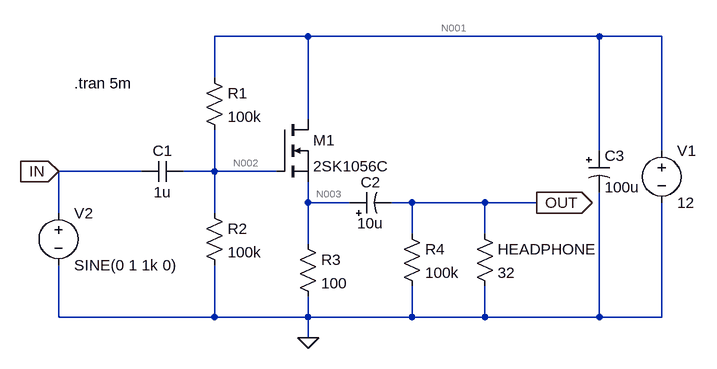
[diagram p0: schematic Circuit7_17.asc]
Circuit7_17.asc, the LTspice schematic file:
Version 4
SHEET 1 880 680
WIRE 160 96 16 96
WIRE 608 96 160 96
WIRE 704 96 608 96
WIRE 16 160 16 96
WIRE 160 224 160 96
WIRE 608 272 608 96
WIRE 704 272 704 96
WIRE -96 304 -224 304
WIRE 16 304 16 240
WIRE 16 304 -32 304
WIRE 112 304 16 304
WIRE 160 352 160 320
WIRE 224 352 160 352
WIRE 320 352 288 352
WIRE 432 352 320 352
WIRE 512 352 432 352
WIRE -224 368 -224 304
WIRE 16 368 16 304
WIRE 320 400 320 352
WIRE 432 400 432 352
WIRE 160 416 160 352
WIRE -224 528 -224 448
WIRE 16 528 16 448
WIRE 16 528 -224 528
WIRE 160 528 160 496
WIRE 160 528 16 528
WIRE 320 528 320 480
WIRE 320 528 160 528
WIRE 432 528 432 480
WIRE 432 528 320 528
WIRE 608 528 608 336
WIRE 608 528 432 528
WIRE 704 528 704 352
WIRE 704 528 608 528
WIRE 160 560 160 528
FLAG 160 560 0
FLAG -224 304 IN
IOPIN -224 304 In
FLAG 512 352 OUT
IOPIN 512 352 Out
SYMBOL voltage 704 256 R0
SYMATTR InstName V1
SYMATTR Value 12
SYMBOL cap -32 288 R90
WINDOW 0 0 32 VBottom 2
WINDOW 3 32 32 VTop 2
SYMATTR InstName C1
SYMATTR Value 1u
SYMBOL res 0 144 R0
SYMATTR InstName R1
SYMATTR Value 100k
SYMBOL res 0 352 R0
SYMATTR InstName R2
SYMATTR Value 100k
SYMBOL res 144 400 R0
SYMATTR InstName R3
SYMATTR Value 100
SYMBOL voltage -224 352 R0
SYMATTR InstName V2
SYMATTR Value SINE(0 1 1k 0)
SYMBOL polcap 224 368 R270
WINDOW 0 32 32 VTop 2
WINDOW 3 0 32 VBottom 2
SYMATTR InstName C2
SYMATTR Value 10u
SYMBOL res 304 384 R0
SYMATTR InstName R4
SYMATTR Value 100k
SYMBOL polcap 592 272 R0
SYMATTR InstName C3
SYMATTR Value 100u
SYMBOL nmos 112 224 R0
SYMATTR InstName M1
SYMATTR Value 2SK1056C
SYMBOL res 416 384 R0
SYMATTR InstName HEADPHONE
SYMATTR Value 32
TEXT -200 168 Left 2 !.tran 5m

The netlist it stands for:
* Circuit7_17.asc
V1 N001 0 12
C1 N002 IN 1u
R1 N001 N002 100k
R2 N002 0 100k
R3 N003 0 100
V2 IN 0 SINE(0 1 1k 0)
C2 N003 OUT 10u
R4 OUT 0 100k
C3 N001 0 100u
M1 N001 N002 N003 N003 2SK1056C
R§HEADPHONE OUT 0 32
.model NMOS NMOS
.model PMOS PMOS
.lib standard.mos
.tran 5m
.backanno
.end

* Results of the author's LTspice run, read from the files saved beside the schematic
* Operating Point, zero values left out:
*   V(n001) = 12 V
*   V(n002) = 6 V
*   V(n003) = 5.603 V
*   Id(M1) = 56.03 mA
*   Is(M1) = -56.03 mA
*   I(R3) = 56.03 mA
*   I(R2) = 60 µA
*   I(R1) = 60 µA
*   I(V1) = -56.09 mA
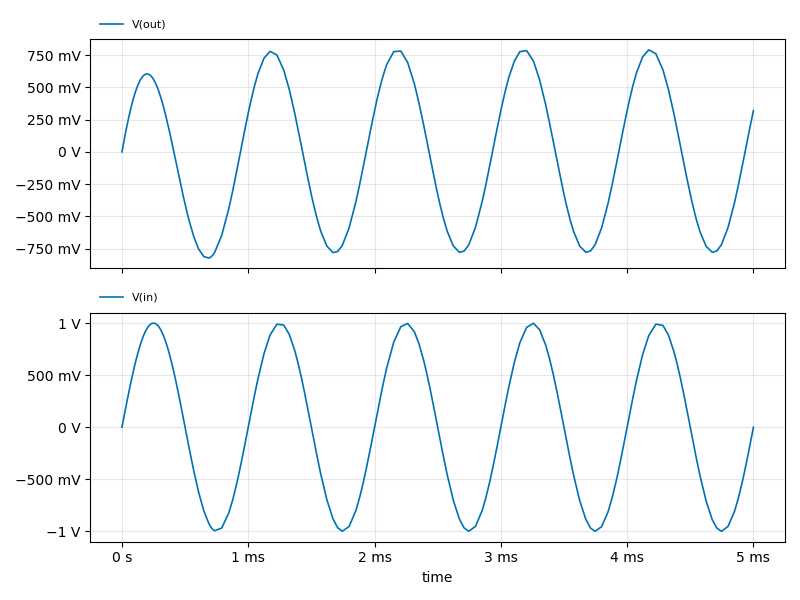
[diagram p1: Transient Analysis of Circuit7_17.asc, plotted from the saved traces]
* Transient Analysis, 1 run:
*   V(out): min -822.9 mV, max 791.3 mV, average -22.68 mV, rms 544.9 mV, last 320.1 mV
*   V(in): min -999.9 mV, max 999.6 mV, average 67.38 µV, rms 704.8 mV, last 0 V